# EAGLE schematic pca_full (EAGLE 6.5.0)
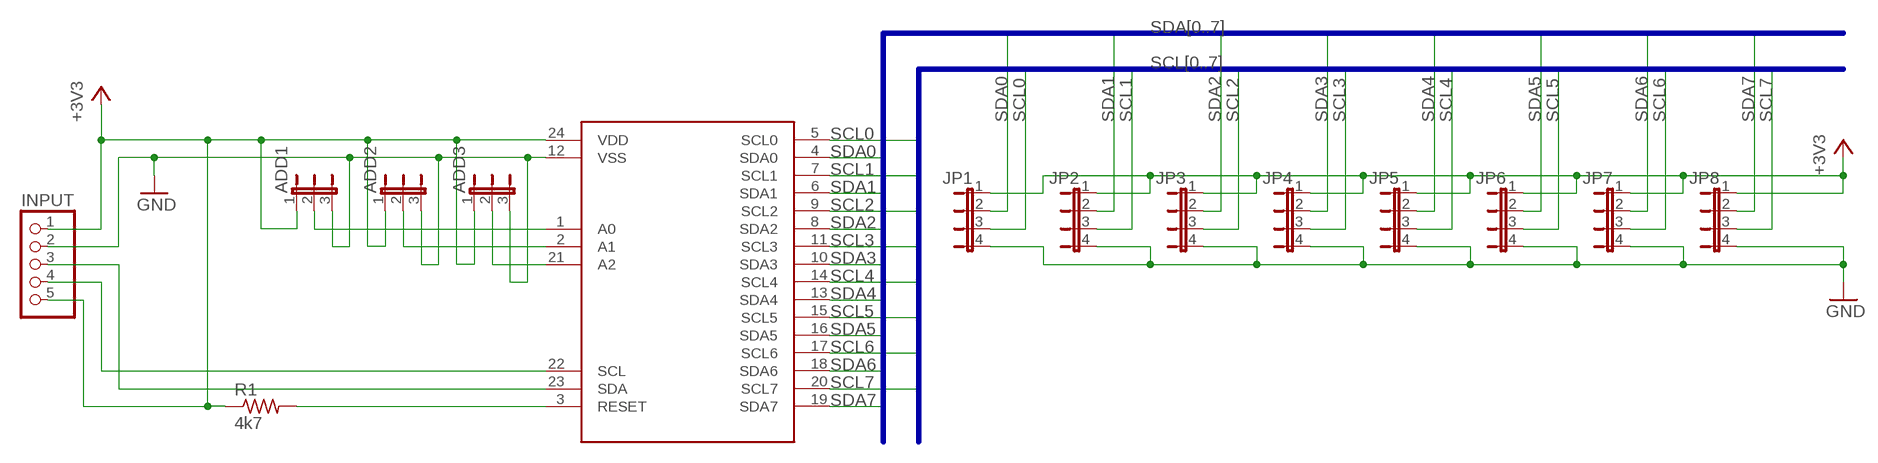
[diagram p0: schematic, sheet 1]

## Parts
ADD1  JP2E  [JP2]
ADD2  JP2E  [JP2]
ADD3  JP2E  [JP2]
INPUT  PINHD-1X5  [1X05]
JP1  JP4E  [JP4]
JP2  JP4E  [JP4]
JP3  JP4E  [JP4]
JP4  JP4E  [JP4]
JP5  JP4E  [JP4]
JP6  JP4E  [JP4]
JP7  JP4E  [JP4]
JP8  JP4E  [JP4]
R1  4k7  R-US_0204/5  [0204/5]
U$1  PCA9547  [SO24]

## Nets
+3V3: ADD1.1 ADD2.1 ADD3.1 INPUT.1 INPUT.5 JP1.1 JP2.1 JP3.1 JP4.1 JP5.1 JP6.1 JP7.1 JP8.1 R1.1 U$1.24(VDD)
GND: ADD1.3 ADD2.3 ADD3.3 INPUT.2 JP1.4 JP2.4 JP3.4 JP4.4 JP5.4 JP6.4 JP7.4 JP8.4 U$1.12(VSS)
N$1: ADD1.2 U$1.1(A0)
N$2: ADD2.2 U$1.2(A1)
N$3: ADD3.2 U$1.21(A2)
N$4: INPUT.4 U$1.22(SCL)
N$5: INPUT.3 U$1.23(SDA)
N$6: R1.2 U$1.3(RESET)
SCL0: JP1.3 U$1.5(SCL0)
SCL1: JP2.3 U$1.7(SCL1)
SCL2: JP3.3 U$1.9(SCL2)
SCL3: JP4.3 U$1.11(SCL3)
SCL4: JP5.3 U$1.14(SCL4)
SCL5: JP6.3 U$1.15(SCL5)
SCL6: JP7.3 U$1.17(SCL6)
SCL7: JP8.3 U$1.20(SCL7)
SDA0: JP1.2 U$1.4(SDA0)
SDA1: JP2.2 U$1.6(SDA1)
SDA2: JP3.2 U$1.8(SDA2)
SDA3: JP4.2 U$1.10(SDA3)
SDA4: JP5.2 U$1.13(SDA4)
SDA5: JP6.2 U$1.16(SDA5)
SDA6: JP7.2 U$1.18(SDA6)
SDA7: JP8.2 U$1.19(SDA7)

## Buses
SDA[0..7]
SCL[0..7]

## Library data of the parts
ADD1-ADD3 = jumper:JP2E: JUMPER
INPUT = pinhead:PINHD-1X5: PIN HEADER
JP1-JP8 = jumper:JP4E: JUMPER
R1 = resistor:R-US_: RESISTOR, American symbol
U$1 = pca9547:PCA9547